# EAGLE schematic Hot_tub_fill_flow_meter (EAGLE 6.5.0)
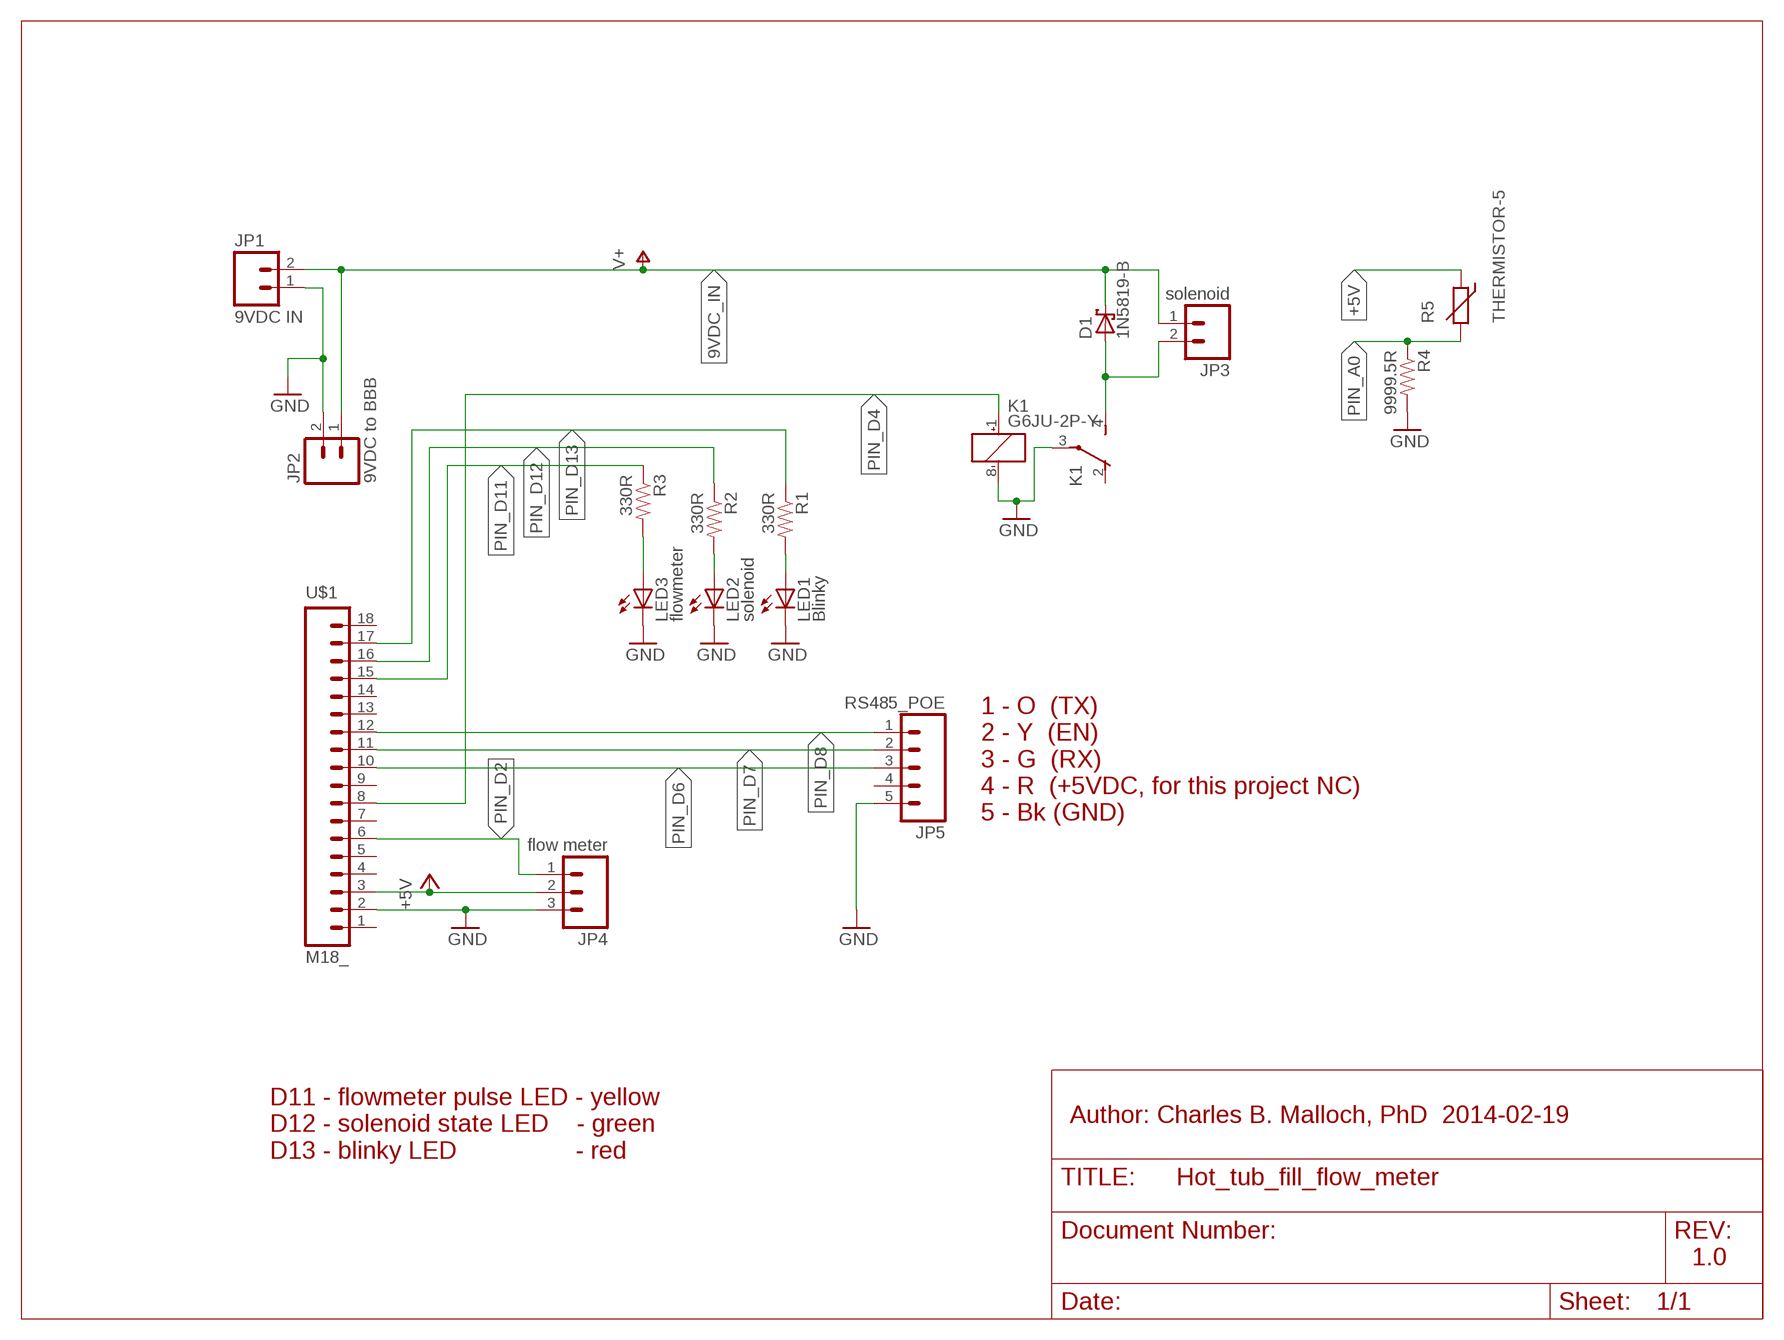
[diagram p0: schematic, sheet 1]

## Parts
D1  1N5819-B  [DO41-7.6]
JP1  9VDC IN  M02LOCK  [1X02_LOCK]
JP2  9VDC to BBB  M02LOCK  [1X02_LOCK]
JP3  solenoid  M02LOCK  [1X02_LOCK]
JP4  flow meter  M03LOCK  [1X03_LOCK]
JP5  RS485_POE  M05PTH  [1X05]
K1  G6JU-2P-Y  [G6J-2P-Y]
LED1  Blinky  LED5MM  [LED5MM]
LED2  solenoid  LED5MM  [LED5MM]
LED3  flowmeter  LED5MM  [LED5MM]
R1  330R  RESISTORAXIAL-0.3  [AXIAL-0.3]
R2  330R  RESISTORAXIAL-0.3  [AXIAL-0.3]
R3  330R  RESISTORAXIAL-0.3  [AXIAL-0.3]
R4  9999.5R  RESISTORAXIAL-0.3  [AXIAL-0.3]
R5  THERMISTOR-5  [R-5]
U$1  M18_  [1X18]

## Nets
9VDC_IN: D1.C JP1.2 JP2.1 JP3.1 ; supply symbol labelled V+
+5V: JP4.2 R5.1 U$1.3
GND: JP1.1 JP2.2 JP4.3 JP5.5 K1.3(2:P) K1.8(1:-) LED1.K(C) LED2.K(C) LED3.K(C) R4.P$2 U$1.2
N$2: LED1.A R1.P$2
N$4: D1.A JP3.2 K1.4(2:S)
N$5: LED2.A R2.P$2
N$6: LED3.A R3.P$2
PIN_A0: R4.P$1 R5.2
PIN_D2: JP4.1 U$1.6
PIN_D4: K1.1(1:+) U$1.8
PIN_D6: JP5.3 U$1.10
PIN_D7: JP5.2 U$1.11
PIN_D8: JP5.1 U$1.12
PIN_D11: R3.P$1 U$1.15
PIN_D12: R2.P$1 U$1.16
PIN_D13: R1.P$1 U$1.17
Unconnected: JP5.4 K1.2(2:O) K1.5(3:S) K1.6(3:P) K1.7(3:O) U$1.1 U$1.4 U$1.5 U$1.7 U$1.9 U$1.13 U$1.14 U$1.18

## Notes on the sheet
- 1 - O  (TX)
  2 - Y  (EN)
  3 - G  (RX)
  4 - R  (+5VDC, for this project NC)
  5 - Bk (GND)
- Author: Charles B. Malloch, PhD  2014-02-19
- D11 - flowmeter pulse LED - yellow
  D12 - solenoid state LED    - green
  D13 - blinky LED                 - red
- 1.0

## Library data of the parts
D1 = diode:1N581*: 1.0A SCHOTTKY BARRIER RECTIFIER Source: http://www.diodes.com/datasheets/ds23001.pdf
JP1-JP3 = SparkFun-Connectors:M02: Header 2 Standard 2-pin 0.1" header. Use with straight break away headers (SKU : PRT-00116), right angle break away headers (PRT-00553), swiss pins (PRT-00743), machine pins (PRT-00117), and female headers (PRT-00115). Molex polarized connector foot print use with SKU : PRT-08233 with associated crimp pins and housings.
JP4 = SparkFun-Connectors:M03: Header 3 Standard 3-pin 0.1" header. Use with straight break away headers (SKU : PRT-00116), right angle break away headers (PRT-00553), swiss pins (PRT-00743), machine pins (PRT-00117), and female headers (PRT-00115). Molex polarized connector foot print use with SKU : PRT-08232 with associated crimp pins and housings.
JP5 = SparkFun-Connectors:M05: Header 5 Standard 5-pin 0.1" header. Use with straight break away headers (SKU : PRT-00116), right angle break away headers (PRT-00553), swiss pins (PRT-00743), machine pins (PRT-00117), and female headers (PRT-00115). Molex polarized connector foot print use with SKU : PRT-08230 with associated crimp pins and housings.
K1 = relay:G6J*-2?-Y: Surface-Mounting Signal Relay - G6J-Y 5.7 x 10.6 x 9 mm Source: http://www.omroncomponents.eu/ .. K125-E2-02-X.pdf; MF: OMRON COMPONENTS USA; MPN: G6JU-2P-Y-DC12; OC_FARNELL: unknown; OC_NEWARK: 70J9842
LED1-LED3 = led:LED: LED OSRAM: - CHIPLED LG R971, LG N971, LY N971, LG Q971, LY Q971, LO R971, LY R971 LH N974, LH R974 LS Q976, LO Q976, LY Q976 LO Q996 - Hyper CHIPLED LW Q18S LB Q993, LB Q99A, LB R99A - SideLED LS A670, LO A670, LY A670, LG A670, LP A670 LB A673, LV A673, LT A673, LW A673 LH A674 LY A675 LS A676, LA A676, LO A676, LY A676, LW A676 LS A679, LY A679, LG A679 - Hyper Micro SIDELED® LS Y876, LA Y876, LO Y876, LY Y876 LT Y87S - SmartLED LW L88C, LW L88S LB L89C, LB L89S, LG L890 LS L89K, LO L89K, LY L89K LS L896, LA L896, LO L896, LY L896 - TOPLED LS T670, LO T670, LY T670, LG T670, LP T670 LSG T670, LSP T670, LSY T670, LOP T670, LYG T670 LG T671, LOG T671, LSG T671 LB T673, LV T673, LT T673, LW T673 LH T674 LS T676, LA T676, LO T676, LY T676, LB T676, LH T676, LSB T676, LW T676 LB T67C, LV T67C, LT T67C, LS T67K, LO T67K, LY T67K, LW E67C LS E67B, LA E67B, LO E67B, LY E67B, LB E67C, LV E67C, LT E67C LW T67C LS T679, LY T679, LG T679 LS T770, LO T770, LY T770, LG T770, LP T770 LB T773, LV T773, LT T773, LW T773 LH T774 LS E675, LA E675, LY E675, LS T675 LS T776, LA T776, LO T776, LY T776, LB T776 LHGB T686 LT T68C, LB T68C - Hyper Mini TOPLED® LB M676 - Mini TOPLED Santana® LG M470 LS M47K, LO M47K, LY M47K Source: http://www.osram.convergy.de LUXEON: - LUMILED® LXK2-PW12-R00, LXK2-PW12-S00, LXK2-PW14-U00, LXK2-PW14-V00 LXK2-PM12-R00, LXK2-PM12-S00, LXK2-PM14-U00 LXK2-PE12-Q00, LXK2-PE12-R00, LXK2-PE12-S00, LXK2-PE14-T00, LXK2-PE14-U00 LXK2-PB12-K00, LXK2-PB12-L00, LXK2-PB12-M00, LXK2-PB14-N00, LXK2-PB14-P00, LXK2-PB14-Q00 LXK2-PR12-L00, LXK2-PR12-M00, LXK2-PR14-Q00, LXK2-PR14-R00 LXK2-PD12-Q00, LXK2-PD12-R00, LXK2-PD12-S00 LXK2-PH12-R00, LXK2-PH12-S00 LXK2-PL12-P00, LXK2-PL12-Q00, LXK2-PL12-R00 Source: www.luxeon.com KINGBRIGHT: KA-3528ASYC Source: www.kingbright.com
R1-R4 = SparkFun-Resistors:RESISTOR: Resistor Basic schematic elements and footprints for 0603, 1206, and PTH resistors.
R5 = varistor:THERMISTOR: THERMISTOR
U$1 = SparkFun-Connectors:M18: 1x18 .1" header